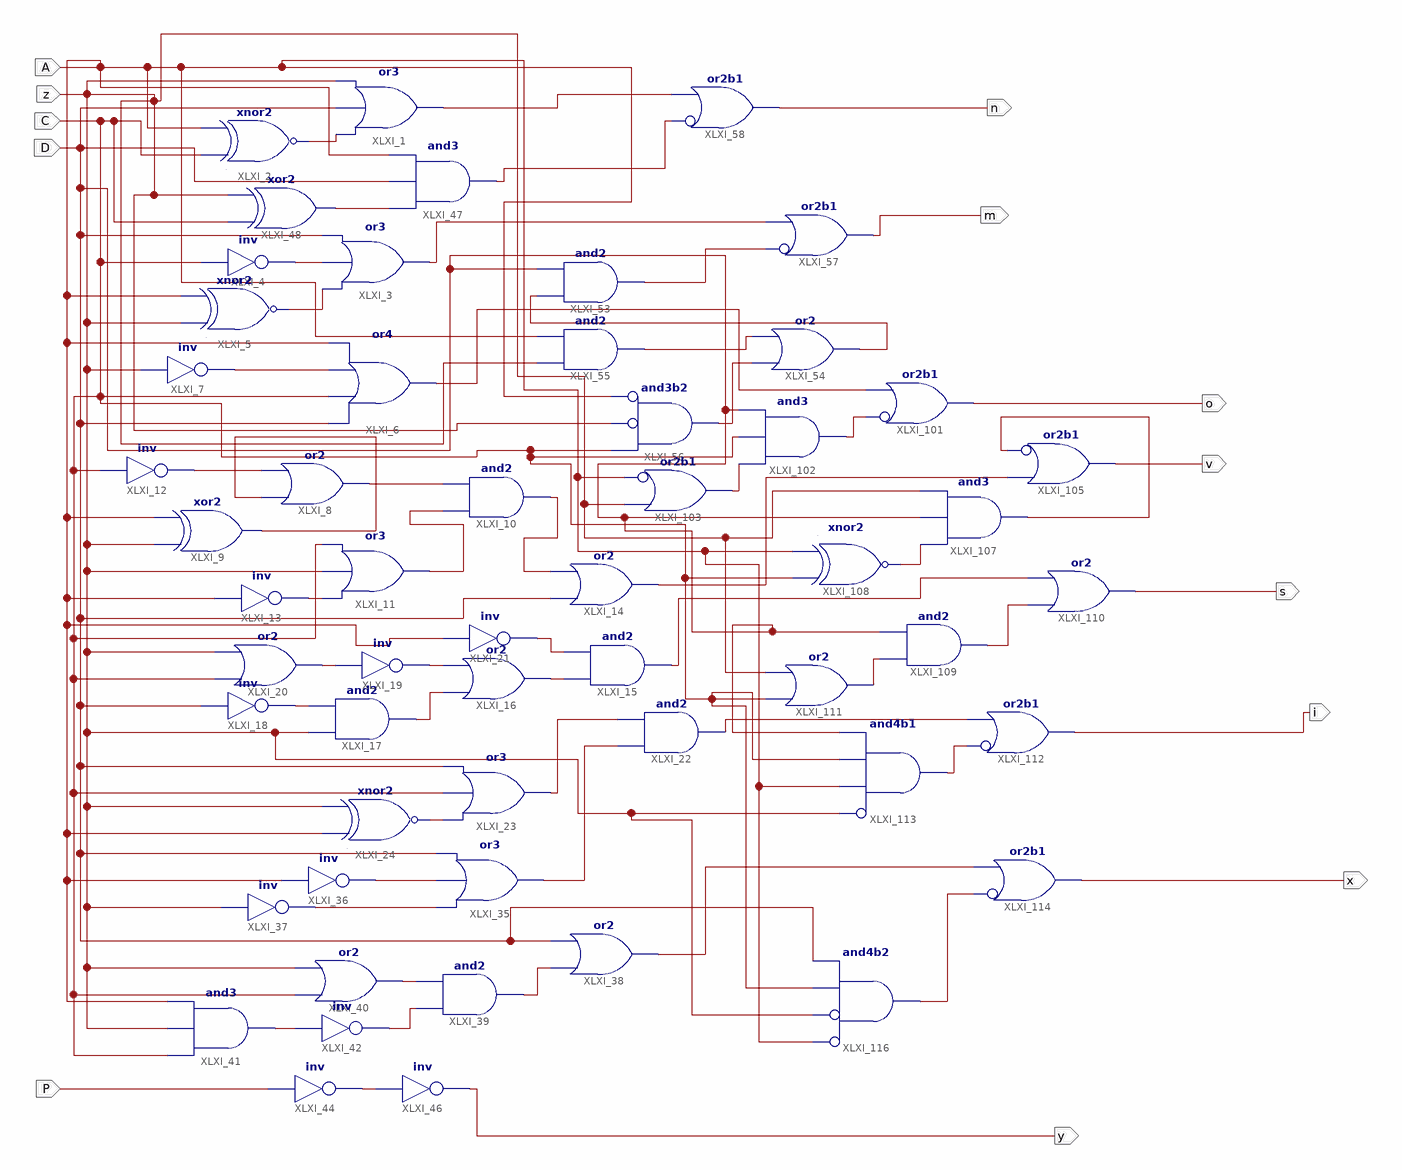
[diagram p0: schematic sheet 1]
// Xilinx ISE schematic SevenSeg.sch (spartan6) as structural Verilog: 55 symbols, 13 ports
module SevenSeg (
  input  C,
  input  A,
  input  D,
  input  P,
  input  z,
  output o,
  output v,
  output s,
  output i,
  output x,
  output y,
  output n,
  output m
);

  wire XLXN_1, XLXN_9, XLXN_10, XLXN_11, XLXN_55, XLXN_60, XLXN_61, XLXN_64, XLXN_76, XLXN_79, XLXN_82,
       XLXN_83, XLXN_84, XLXN_87, XLXN_88, XLXN_91, XLXN_93, XLXN_96, XLXN_99, XLXN_102, XLXN_105, XLXN_111,
       XLXN_112, XLXN_113, XLXN_114, XLXN_116, XLXN_120, XLXN_122, XLXN_136, XLXN_139, XLXN_146, XLXN_147,
       XLXN_211, XLXN_214, XLXN_215, XLXN_219, XLXN_222, XLXN_223, XLXN_236, XLXN_240;

  or XLXI_3 (m, XLXN_10, XLXN_9, D);
  not XLXI_4 (XLXN_9, C);
  xnor XLXI_5 (XLXN_10, z, A);
  or XLXI_6 (o, D, C, XLXN_11, A);
  not XLXI_7 (XLXN_11, z);
  or XLXI_8 (XLXN_55, XLXN_61, XLXN_60);
  xor XLXI_9 (XLXN_61, z, A);
  and XLXI_10 (XLXN_79, XLXN_64, XLXN_55);
  or XLXI_11 (XLXN_64, XLXN_76, z, C);
  not XLXI_12 (XLXN_60, C);
  not XLXI_13 (XLXN_76, A);
  or XLXI_14 (v, D, XLXN_79);
  and XLXI_15 (s, XLXN_82, XLXN_91);
  or XLXI_16 (XLXN_82, XLXN_83, XLXN_87);
  and XLXI_17 (XLXN_83, z, XLXN_84);
  not XLXI_18 (XLXN_84, D);
  not XLXI_19 (XLXN_87, XLXN_88);
  or XLXI_20 (XLXN_88, C, z);
  not XLXI_21 (XLXN_91, A);
  and XLXI_22 (i, XLXN_99, XLXN_93);
  or XLXI_23 (XLXN_93, XLXN_96, C, D);
  xnor XLXI_24 (XLXN_96, A, z);
  or XLXI_35 (XLXN_99, XLXN_105, XLXN_102, D);
  not XLXI_36 (XLXN_102, A);
  not XLXI_37 (XLXN_105, z);
  or XLXI_38 (x, XLXN_111, D);
  and XLXI_39 (XLXN_111, XLXN_114, XLXN_112);
  or XLXI_40 (XLXN_112, C, z);
  and XLXI_41 (XLXN_113, C, z, A);
  not XLXI_42 (XLXN_114, XLXN_113);
  not XLXI_44 (XLXN_116, P);
  not XLXI_46 (y, XLXN_116);
  or XLXI_1 (XLXN_122, XLXN_1, D, z);
  xnor XLXI_2 (XLXN_1, C, A);
  and XLXI_47 (n, XLXN_120, D, A);
  xor XLXI_48 (XLXN_120, C, z);
  and XLXI_53 (XLXN_147, XLXN_136, D);
  or XLXI_54 (XLXN_136, XLXN_146, XLXN_139);
  and XLXI_55 (XLXN_139, z, A);
  and XLXI_56 (XLXN_146, ~A, ~z, C);  // and3b2
  or XLXI_57 (m, ~XLXN_147, m);  // or2b1
  or XLXI_101 (o, ~XLXN_211, o);  // or2b1
  and XLXI_102 (XLXN_211, XLXN_214, C, D);
  or XLXI_103 (XLXN_214, ~A, z);  // or2b1
  or XLXI_105 (v, ~XLXN_215, v);  // or2b1
  and XLXI_107 (XLXN_215, z, D, XLXN_219);
  xnor XLXI_108 (XLXN_219, A, C);
  and XLXI_109 (XLXN_222, D, XLXN_223);
  or XLXI_110 (s, s, XLXN_222);
  or XLXI_111 (XLXN_223, z, C);
  or XLXI_112 (i, ~XLXN_236, i);  // or2b1
  and XLXI_113 (XLXN_236, ~z, A, C, D);  // and4b1
  or XLXI_114 (x, ~XLXN_240, x);  // or2b1
  and XLXI_116 (XLXN_240, ~A, ~z, C, D);  // and4b2
  or XLXI_58 (n, ~n, XLXN_122);  // or2b1
endmodule
